# Altium schematic sheet 9-LCD.SchDoc
size A4
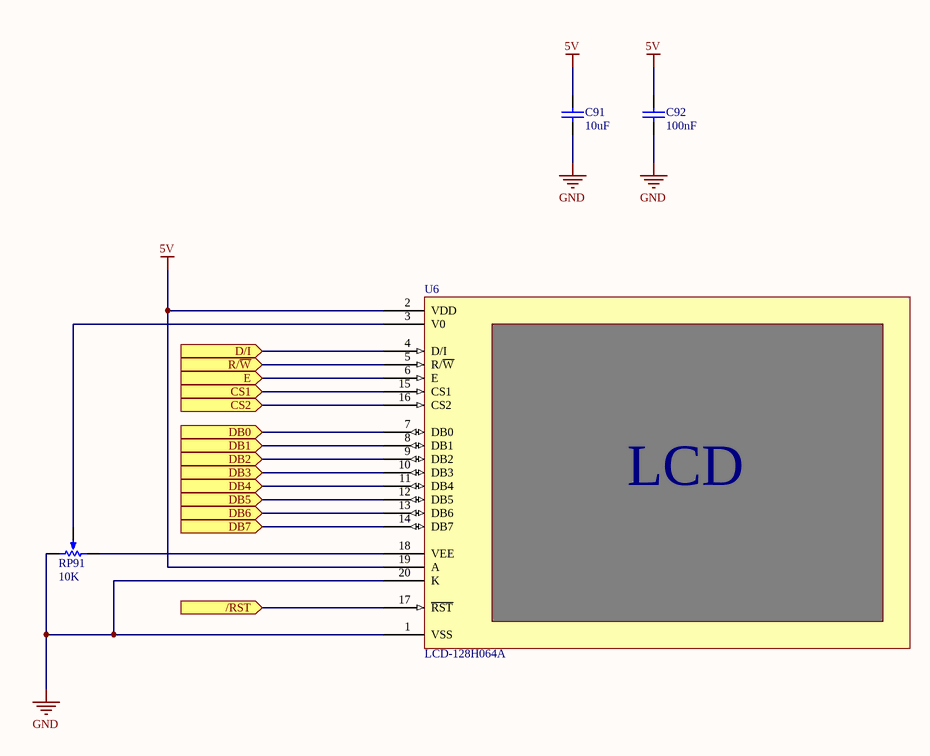
[diagram p0: 9-LCD.SchDoc]

## Parts
C91  10uF  [capa 1206]
C92  100nF  [capa 1206]
RP91  10K  [3313J-1]
U6  LCD-128H064A  [LCD-128H064A]

## Ports
/RST (in), CS1 (in), CS2 (in), D/I (in), DB0 (in), DB1 (in), DB2 (in), DB3 (in), DB4 (in), DB5 (in), DB6 (in), DB7 (in), E (in), R/~{W} (in)

## Nets
5V: C91.1 C92.1 U6.2(VDD) U6.19(A)
GND: C91.2 C92.2 RP91.2(BOT) U6.1(VSS) U6.20(K)
/RST: U6.17(~{RST}) ; port /RST
CS1: U6.15(CS1) ; port CS1
CS2: U6.16(CS2) ; port CS2
D/I: U6.4(D/I) ; port D/I
DB0: U6.7(DB0) ; port DB0
DB1: U6.8(DB1) ; port DB1
DB2: U6.9(DB2) ; port DB2
DB3: U6.10(DB3) ; port DB3
DB4: U6.11(DB4) ; port DB4
DB5: U6.12(DB5) ; port DB5
DB6: U6.13(DB6) ; port DB6
DB7: U6.14(DB7) ; port DB7
E: U6.6(E) ; port E
R/~{W}: U6.5(R/~{W}) ; port R/~{W}
NetRP91_1: RP91.1(TOP) U6.18(VEE)
NetRP91_3: RP91.3(TAP) U6.3(V0)

## Notes on the sheet
- (in symbol LCD-128H064A) LCD

## Library data of the parts
C91 = Cap: Capacitor; Fabricant: MULTICOMP; Fournisseur: Farnell; RefFabricant: MC1206X106K160CT; RefFournisseur: 2320922
C92 = Cap: Capacitor; Fabricant: MULTICOMP; Fournisseur: Farnell; RefFabricant: MC1206B104K500CT; RefFournisseur: 1759361
RP91 = RPot: Potentiometer; Fabricant: BOURNS; Fournisseur: Farnell; RefFabricant: 3313J-1-103E; RefFournisseur: 1612588
U6 = LCD-128H064A: Fournisseur: Adafruit; RefFabricant: KS0108; RefFournisseur: 188; Fabricant: N/A